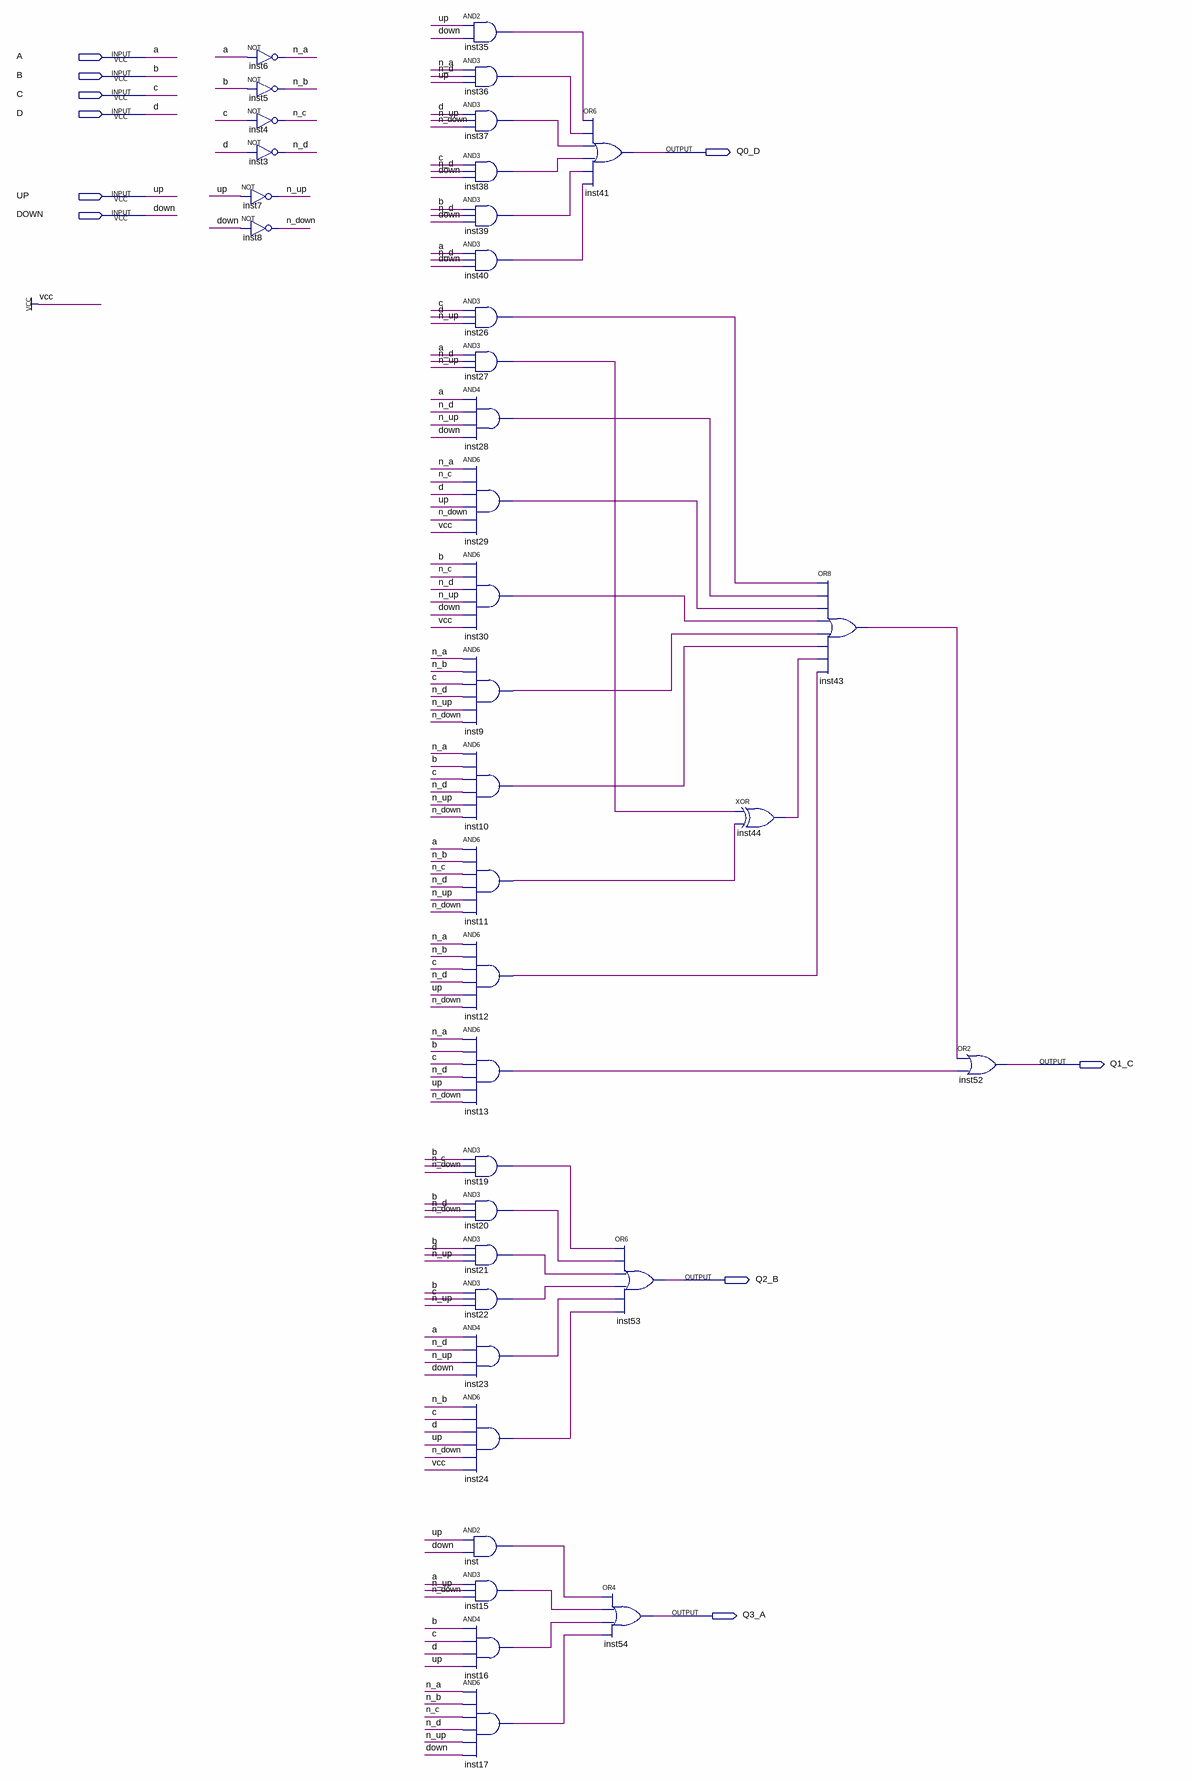
[diagram p0: schematic sheet]
// Quartus schematic Circuito_Combinacional_ENTRADA.bdf as structural Verilog: 38 symbols, 10 pins
module Circuito_Combinacional_ENTRADA (
  input  A,
  input  B,
  input  C,
  input  D,
  input  UP,
  input  DOWN,
  output Q0_D,
  output Q1_C,
  output Q2_B,
  output Q3_A
);

  wire inst9_out, inst10_out, inst11_out, inst12_out, inst13_out, inst15_out, inst16_out, inst17_out,
       inst19_out, inst20_out, inst21_out, inst22_out, inst23_out, inst24_out, inst26_out, inst27_out,
       inst28_out, inst29_out, inst30_out, inst35_out, inst36_out, inst37_out, inst38_out, inst39_out,
       inst40_out, inst43_out, inst44_out, inst_out, n_a, n_b, n_c, n_d, n_down, n_up;

  not inst6 (n_a, A);
  not inst5 (n_b, B);
  not inst4 (n_c, C);
  not inst3 (n_d, D);
  not inst7 (n_up, UP);
  not inst8 (n_down, DOWN);
  and inst35 (inst35_out, UP, DOWN);
  and inst36 (inst36_out, n_a, n_d, UP);
  and inst37 (inst37_out, D, n_up, n_down);
  and inst38 (inst38_out, C, n_d, DOWN);
  and inst39 (inst39_out, B, n_d, DOWN);
  and inst40 (inst40_out, A, n_d, DOWN);
  and inst26 (inst26_out, C, D, n_up);
  and inst27 (inst27_out, A, n_d, n_up);
  and inst28 (inst28_out, A, n_d, n_up, DOWN);
  and inst29 (inst29_out, n_a, n_c, D, UP, n_down, 1'b1);
  and inst30 (inst30_out, B, n_c, n_d, n_up, DOWN, 1'b1);
  and inst9 (inst9_out, n_a, n_b, C, n_d, n_up, n_down);
  and inst10 (inst10_out, n_a, B, C, n_d, n_up, n_down);
  and inst11 (inst11_out, A, n_b, n_c, n_d, n_up, n_down);
  and inst12 (inst12_out, n_a, n_b, C, n_d, UP, n_down);
  and inst13 (inst13_out, n_a, B, C, n_d, UP, n_down);
  and inst19 (inst19_out, B, n_c, n_down);
  and inst20 (inst20_out, B, n_d, n_down);
  and inst21 (inst21_out, B, D, n_up);
  and inst22 (inst22_out, B, C, n_up);
  and inst23 (inst23_out, A, n_d, n_up, DOWN);
  and inst24 (inst24_out, n_b, C, D, UP, n_down, 1'b1);
  and inst (inst_out, UP, DOWN);
  and inst15 (inst15_out, A, n_up, n_down);
  and inst16 (inst16_out, B, C, D, UP);
  and inst17 (inst17_out, n_a, n_b, n_c, n_d, n_up, DOWN);
  or inst41 (Q0_D, inst35_out, inst36_out, inst37_out, inst38_out, inst39_out, inst40_out);
  or inst54 (Q3_A, inst_out, inst15_out, inst16_out, inst17_out);
  or inst53 (Q2_B, inst19_out, inst20_out, inst21_out, inst22_out, inst23_out, inst24_out);
  xor inst44 (inst44_out, inst27_out, inst11_out);
  or inst43 (inst43_out, inst26_out, inst28_out, inst29_out, inst30_out, inst9_out, inst10_out, inst44_out, inst12_out);
  or inst52 (Q1_C, inst43_out, inst13_out);
endmodule
